# EAGLE design adc (EAGLE 7.6.0)
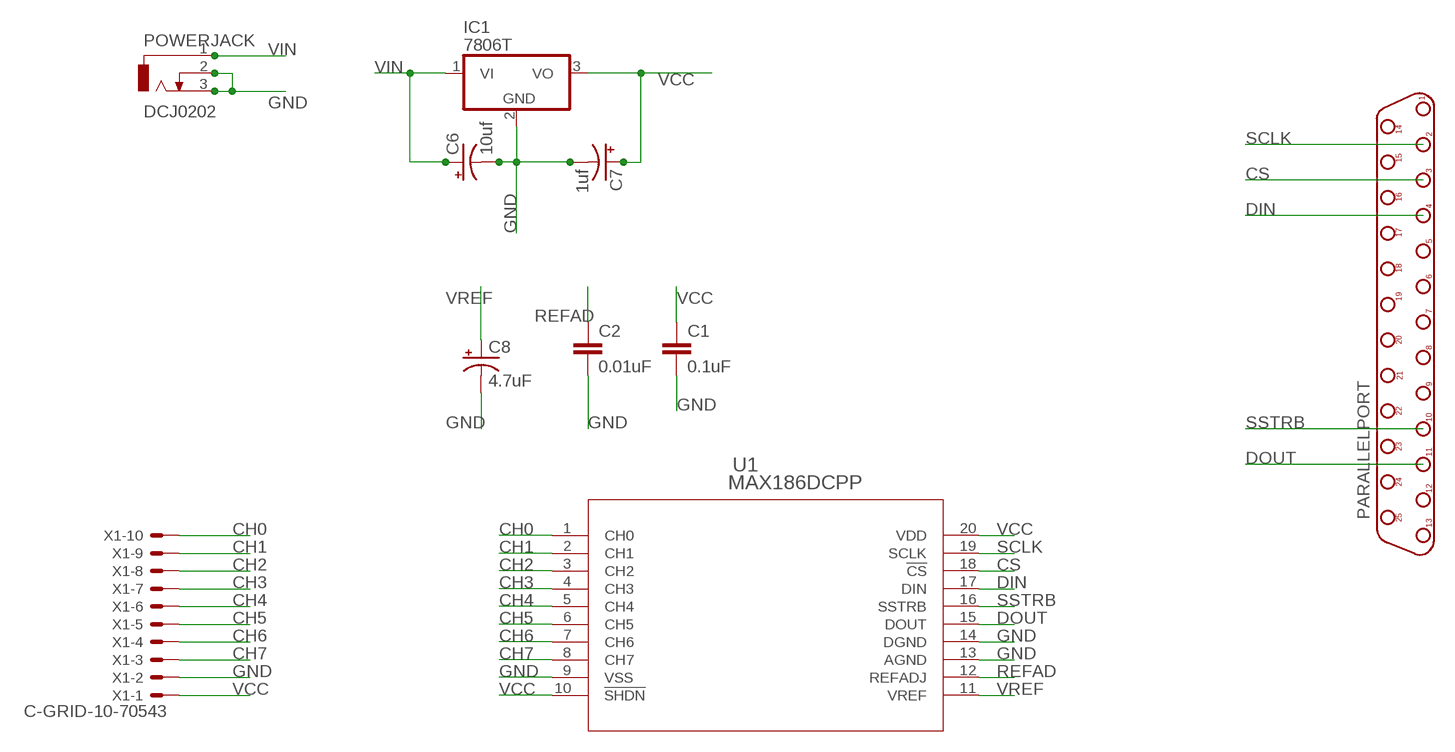
[diagram p0: schematic, sheet 1]

## Parts
C1  0.1uF  C-EU050-035X075  [C050-035X075]
C2  0.01uF  C-EU050-035X075  [C050-035X075]
C6  10uf  CPOL-USE2-5  [E2-5]
C7  1uf  CPOL-USE2-5  [E2-5]
C8  4.7uF  CPOL-USE2-5  [E2-5]
IC1  7806T  [TO220H]
PARALLELPORT  DB25F  [D-25F]
POWERJACK  DCJ0202  [DCJ0202]
U1  MAX186DCPP  [21-0043D_20]
X1  C-GRID-10-70543  [70543-10]

## Nets
CH0: U1.1(CH0) X1.10
CH1: U1.2(CH1) X1.9
CH2: U1.3(CH2) X1.8
CH3: U1.4(CH3) X1.7
CH4: U1.5(CH4) X1.6
CH5: U1.6(CH5) X1.5
CH6: U1.7(CH6) X1.4
CH7: U1.8(CH7) X1.3
CS: PARALLELPORT.3 U1.18(!CS)
DIN: PARALLELPORT.4 U1.17(DIN)
DOUT: PARALLELPORT.11 U1.15(DOUT)
GND: C1.2 C2.2 C6.- C7.- C8.- IC1.2(GND) POWERJACK.2 POWERJACK.3 U1.9(VSS) U1.13(AGND) U1.14(DGND) X1.2
REFAD: C2.1 U1.12(REFADJ)
SCLK: PARALLELPORT.2 U1.19(SCLK)
SSTRB: PARALLELPORT.10 U1.16(SSTRB)
VCC: C1.1 C7.+ IC1.3(VO) U1.10(!SHDN) U1.20(VDD) X1.1
VIN: C6.+ IC1.1(VI) POWERJACK.1
VREF: C8.+ U1.11(VREF)
Unconnected: PARALLELPORT.1 PARALLELPORT.5 PARALLELPORT.6 PARALLELPORT.7 PARALLELPORT.8 PARALLELPORT.9 PARALLELPORT.12 PARALLELPORT.13 PARALLELPORT.14 PARALLELPORT.15 PARALLELPORT.16 PARALLELPORT.17 PARALLELPORT.18 PARALLELPORT.19 PARALLELPORT.20 PARALLELPORT.21 PARALLELPORT.22 PARALLELPORT.23 PARALLELPORT.24 PARALLELPORT.25

## Library data of the parts
C1 = resistor:C-EU: CAPACITOR, European symbol; OC_NEWARK: unknown
C2 = resistor:C-EU: CAPACITOR, European symbol; MPN: B32529C1103J189; OC_NEWARK: 94W2340
C6-C8 = rcl:CPOL-US: POLARIZED CAPACITOR, American symbol; OC_NEWARK: unknown
IC1 = linear:78*: Positive VOLTAGE REGULATOR Source: http://cache.national.com/ds/LM/LM78L05.pdf http://www.fairchildsemi.com/ds/LM/LM7805.pdf; OC_NEWARK: unknown
PARALLELPORT = connect:DB25F; OC_NEWARK: unknown
POWERJACK = con-jack:DCJ0202: DC POWER JACK Source: DCJ0202.pdf; OC_FARNELL: unknown; OC_NEWARK: unknown
U1 = max186:MAX186DCPP; MANUFACTURER_PART_NUMBER: MAX186DCPP; OC_NEWARK: unknown; VENDOR: Maxim Integrated Products
X1 = con-molex:C-GRID-10: CONNECTOR wire to board 2.54 mm (0.100") pitch header; OC_FARNELL: unknown; OC_NEWARK: unknown

## Board
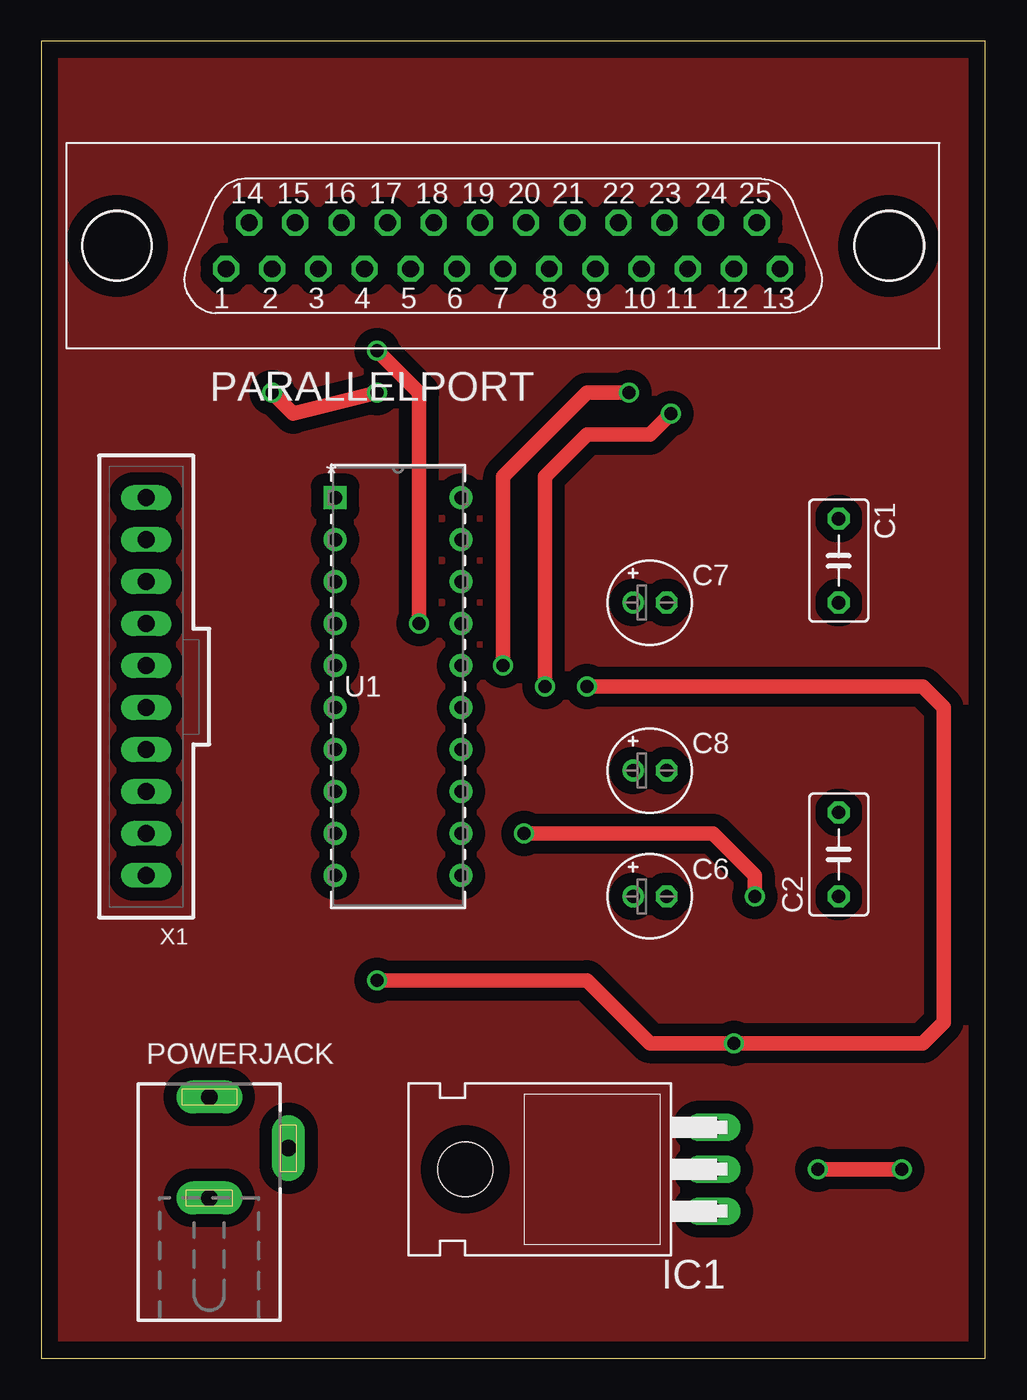
[diagram p1: board, top side]
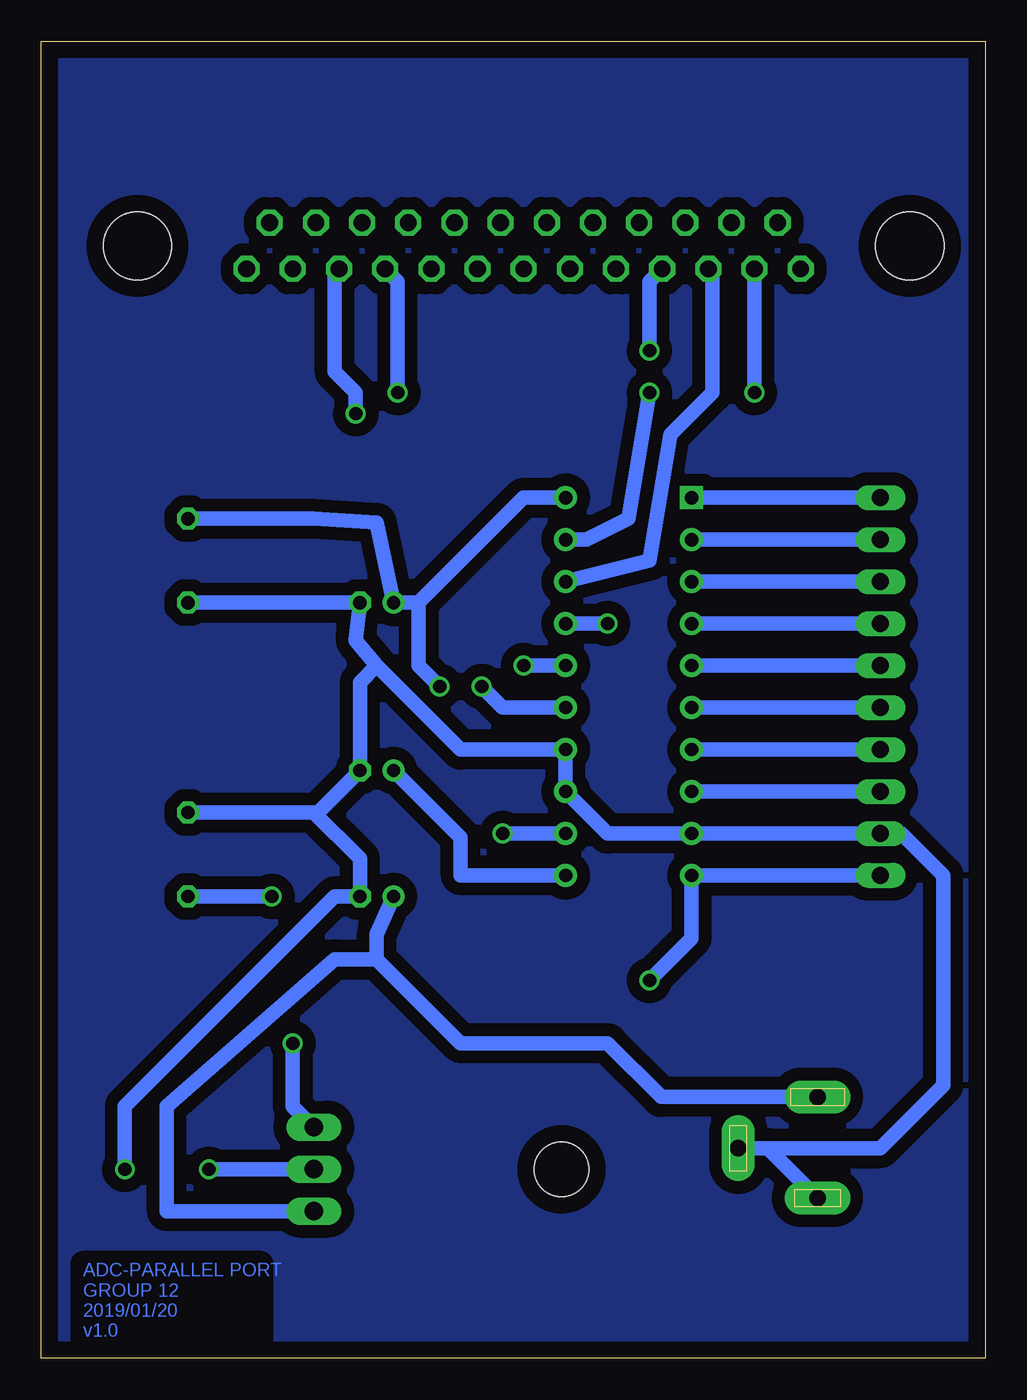
[diagram p2: board, bottom side, seen from below]

Size 57.13 x 79.68 mm. Coordinates in mm from the lower left corner, seen from the top.
Outline: 0,0 57.13,0 57.13,79.68 0,79.68 0,0
Copper layers (1*16): Top 0.035mm / dielectric 1.5mm / Bottom 0.035mm
Design rules "default *": minimum track width 15mil, minimum drill 25mil, track to track 30mil, track to pad 30mil, pad to pad 30mil, via to via 30mil, smd to smd 30mil, copper to edge 40mil, drill to drill 20mil, minimum pad ring 10mil, minimum via ring 8mil, stop-mask expansion 4mil, vias tented up to drill 0mil, thermal gap 10mil

### Footprints (pad centres in the part's own frame; a part is rotated, then mirrored left to right if it is on the bottom)
C050-035X075 = drill 0.813 octagon: 1 -2.54,0; 2 2.54,0
E2-5 = drill 0.813 pad 1.27: + -1.016,0 | drill 0.813 pad 1.27 octagon: - 1.016,0
TO220H = drill 1.118 long: 1 -2.54,-10.16; 2 0,-10.16; 3 2.54,-10.16 | hole 3.302: 0,4.826
D-25F = drill 1.016 pad 1.575 octagon: 1 16.764,1.397; 2 13.97,1.397; 3 11.176,1.397; 4 8.382,1.397; 5 5.588,1.397; 6 2.794,1.397; 7 0,1.397; 8 -2.794,1.397; 9 -5.588,1.397; 10 -8.382,1.397; 11 -11.176,1.397; 12 -13.97,1.397; 13 -16.764,1.397; 14 15.367,-1.397; 15 12.573,-1.397; 16 9.779,-1.397; 17 6.985,-1.397; 18 4.191,-1.397; 19 1.397,-1.397; 20 -1.397,-1.397; 21 -4.191,-1.397; 22 -6.985,-1.397; 23 -9.779,-1.397; 24 -12.573,-1.397; 25 -15.367,-1.397 | hole 4.115: 23.368,0; -23.368,0
DCJ0202 = drill 1 pad 2 long: 1 0,3.1; 2 4.8,0; 3 0,-3
21-0043D_20 = drill 0.813 pad 1.397 square: 1 -7.62,22.86 | drill 0.813 pad 1.397: 2 -7.62,20.32; 3 -7.62,17.78; 4 -7.62,15.24; 5 -7.62,12.7; 6 -7.62,10.16; 7 -7.62,7.62; 8 -7.62,5.08; 9 -7.62,2.54; 10 -7.62,0; 11 0,0; 12 0,2.54; 13 0,5.08; 14 0,7.62; 15 0,10.16; 16 0,12.7; 17 0,15.24; 18 0,17.78; 19 0,20.32; 20 0,22.86
70543-10 = drill 1.016 long: 1 -11.43,0; 2 -8.89,0; 3 -6.35,0; 4 -3.81,0; 5 -1.27,0; 6 1.27,0; 7 3.81,0; 8 6.35,0; 9 8.89,0; 10 11.43,0

### Placement (x,y rotation side)
C1  48.26,48.26 270 top
C2  48.26,30.48 90 top
C6  36.83,27.94 0 top
C7  36.83,45.72 0 top
C8  36.83,35.56 0 top
IC1  30.48,11.43 90 top
PARALLELPORT  27.94,67.31 180 top
POWERJACK  10.16,12.7 0 top
U1  25.4,29.21 0 top
X1  6.35,40.64 90 top

### Tracks (layer width: path | path; a pad name or v marks a point on that pad's centre or on a via)
CH0
  Bottom 0.889: X1.10 U1.1
CH1
  Bottom 0.889: X1.9 U1.2
CH2
  Bottom 0.889: X1.8 U1.3
CH3
  Bottom 0.889: X1.7 U1.4
CH4
  Bottom 0.889: X1.6 U1.5
CH5
  Bottom 0.889: X1.5 U1.6
CH6
  Bottom 0.889: U1.7 X1.4
CH7
  Bottom 0.889: X1.3 U1.8
CS
  Bottom 0.889: U1.18 20.32,48.26 19.05,55.88 16.51,58.42 16.51,65.66 PARALLELPORT.3
DIN  (via drill 0.8, 0.8 pad 0.81)
  Top 0.889: v22.86,44.45 22.86,58.42 v20.32,60.96
  Bottom 0.889: U1.17 v22.86,44.45 | v20.32,60.96 20.32,65.15 PARALLELPORT.4
DOUT  (via drill 0.8)
  Top 0.889: v30.48,40.64 30.48,53.34 33.02,55.88 36.83,55.88 v38.1,57.15
  Bottom 0.889: U1.15 29.21,39.37 v30.48,40.64 | v38.1,57.15 38.1,58.42 39.37,59.69 39.37,65.66 PARALLELPORT.11
GND  (via drill 0.8)
  Top 0.889: v52.07,11.43 v46.99,11.43
  Bottom 0.406: POWERJACK.2 13.16,12.7
  Bottom 0.889: 13.16,12.7 POWERJACK.3 | 36.83,41.91 31.75,36.83 U1.14 U1.13 22.86,31.75 U1.9 X1.2 5.08,31.75 2.54,29.21 2.54,16.51 6.35,12.7 POWERJACK.2 | 36.83,41.91 38.1,43.43 C7.- C1.2 | C2.2 40.64,33.02 | 40.64,33.02 40.39,33.02 C8.- 37.85,40.89 36.83,41.91 | 40.64,33.02 37.85,30.23 C6.- 39.37,27.94 52.07,15.24 v52.07,11.43 | v46.99,11.43 IC1.2
N$1
  pour Top: 0,80.01 57.15,80.01 57.15,0 0,0
N$2
  pour Bottom: 0,80.01 57.15,80.01 57.15,78.74 57.15,0 0,0
REFAD  (via drill 0.8)
  Top 0.889: v29.21,31.75 40.64,31.75 43.18,29.21 v43.18,27.94
  Bottom 0.889: U1.12 v29.21,31.75 | v43.18,27.94 C2.1
SCLK  (via drill 0.8)
  Top 0.889: v20.32,58.42 15.24,57.15 v13.97,58.42
  Bottom 0.889: U1.19 24.13,49.53 21.59,50.8 v20.32,58.42 | v13.97,58.42 PARALLELPORT.2
SSTRB  (via drill 0.8)
  Top 0.889: v27.94,41.91 27.94,53.34 33.02,58.42 v35.56,58.42
  Bottom 0.889: U1.16 v27.94,41.91 | v35.56,58.42 35.56,65.15 PARALLELPORT.10
VCC  (via drill 0.8)
  Top 0.889: v20.32,22.86 33.02,22.86 36.83,19.05 v41.91,19.05 53.34,19.05 54.61,20.32 54.61,39.37 53.34,40.64 v33.02,40.64
  Bottom 0.889: v20.32,22.86 17.78,25.4 U1.10 X1.1 | v41.91,19.05 41.91,15.24 IC1.3 | 34.29,45.72 C7.+ 36.83,50.55 40.64,50.8 C1.1 | 34.29,45.72 27.94,52.07 U1.20 | 34.29,45.72 34.29,41.91 v33.02,40.64
VIN
  Bottom 0.889: IC1.1 49.53,8.89 49.53,15.24 39.37,24.13 36.83,24.13 | 36.83,24.13 36.83,25.65 C6.+ | POWERJACK.1 19.61,15.8 22.86,19.05 31.75,19.05 36.83,24.13
VREF
  Bottom 0.889: U1.11 31.75,29.21 31.75,31.5 C8.+

### Text on the board
Bottom: ADC-PARALLEL PORT / GROUP 12 / 2019/01/20 / v1.0